# Altium schematic sheet LOADS AND POWER.SchDoc
size A4; SheetNumber: 4; SheetTotal: 4
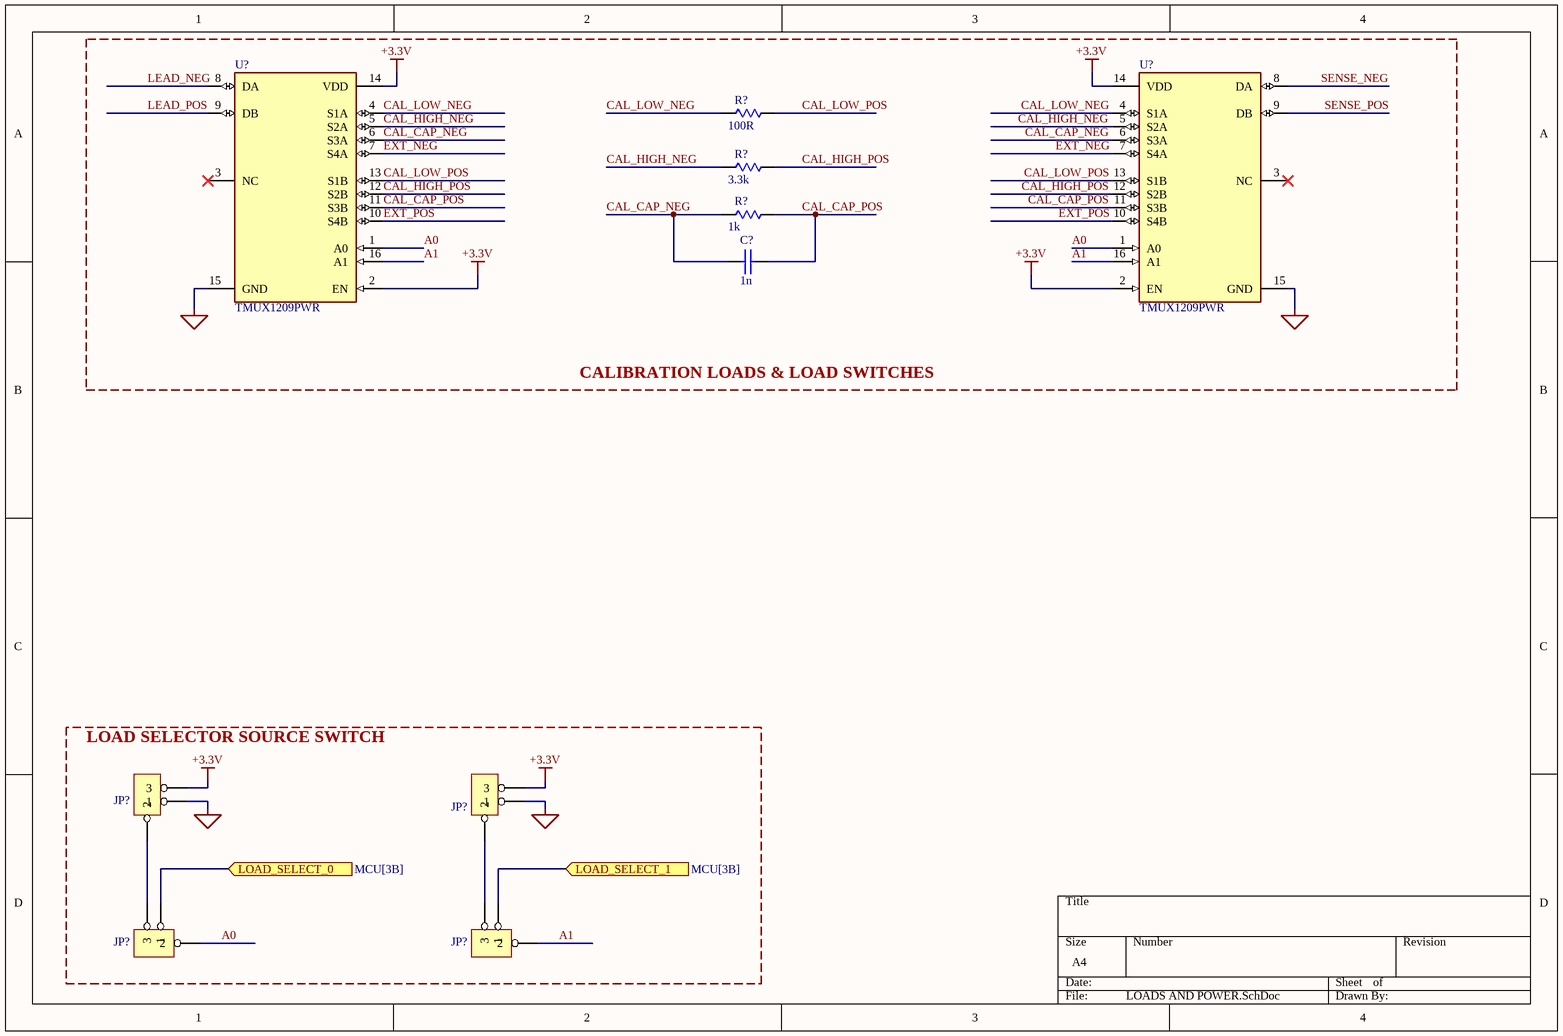
[diagram p0: LOADS AND POWER.SchDoc]

## Parts
(Parts that share a designator on the sheet are numbered #1, #2 ... from top to bottom, then left to right.)
C?  1n  [0805-CAP]
JP?#1  JUMPER1X3  [JUMPER3]  (value not drawn)
JP?#2  JUMPER1X3  [JUMPER3]  (value not drawn)
JP?#3  JUMPER1X3  [JUMPER3]  (value not drawn)
JP?#4  JUMPER1X3  [JUMPER3]  (value not drawn)
R?#1  100R  [0805-RES]
R?#2  3.3k  [0805-RES]
R?#3  1k  [0805-RES]
U?#1  TMUX1209PWR  [FP-PW0016A-MFG]
U?#2  TMUX1209PWR  [FP-PW0016A-MFG]

## Blocks framed on the sheet
CALIBRATION LOADS & LOAD SWITCHES: C? R?#1-R?#3 U?#1 U?#2
LOAD SELECTOR SOURCE SWITCH: JP?#1-JP?#4

## Ports
LOAD_SELECT_0 (in, see MCU[3B]), LOAD_SELECT_1 (in, see MCU[3B])

## Nets
+3.3V: JP?#1.3 JP?#2.3 U?#1.2(EN) U?#1.14(VDD) U?#2.2(EN) U?#2.14(VDD)
GND: JP?#1.1 JP?#2.1 U?#1.15(GND) U?#2.15(GND)
A0: JP?#3.2 U?#1.1(A0) U?#2.1(A0)
A1: JP?#4.2 U?#1.16(A1) U?#2.16(A1)
CAL_CAP_NEG: C?.1 R?#3.2 U?#1.6(S3A) U?#2.6(S3A)
CAL_CAP_POS: C?.2 R?#3.1 U?#1.11(S3B) U?#2.11(S3B)
CAL_HIGH_NEG: R?#2.2 U?#1.5(S2A) U?#2.5(S2A)
CAL_HIGH_POS: R?#2.1 U?#1.12(S2B) U?#2.12(S2B)
CAL_LOW_NEG: R?#1.2 U?#1.4(S1A) U?#2.4(S1A)
CAL_LOW_POS: R?#1.1 U?#1.13(S1B) U?#2.13(S1B)
EXT_NEG: U?#1.7(S4A) U?#2.7(S4A)
EXT_POS: U?#1.10(S4B) U?#2.10(S4B)
LEAD_NEG: U?#1.8(DA)
LEAD_POS: U?#1.9(DB)
LOAD_SELECT_0: JP?#3.1 ; port LOAD_SELECT_0
LOAD_SELECT_1: JP?#4.1 ; port LOAD_SELECT_1
SENSE_NEG: U?#2.8(DA)
SENSE_POS: U?#2.9(DB)
NetJP?#1_2: JP?#1.2 JP?#3.3
NetJP?#2_2: JP?#2.2 JP?#4.3

Not connected (* = marked no-connect by the designer): U?#1 3(NC)*; U?#2 3(NC)*

## Library data of the parts
C? = CL21B104KCFNNNE: CAP CER 100pF C0G 0805; Manufacturer 1: Samsung; Detailed Description: CAP CER 0.1UF 100V X7R 0805; Tech#: SMT; Manufacturer Part Number 1: CL21B104KCFNNNE; Supplier 1: DigiKey; Supplier Part Number 1: 1276-6840-1-ND; Supplier 2: Mouser; Supplier Part Number 2: 791-0603B104K101CT; Price(100): 0.019
JP?#1-JP?#4 = 68001-203HLF: CONN HEADER VERT 36POS 2.54MM; Manufacturer 1: FCI; Detailed Description: Jumper, 1x3 Vertical T/H 0.1in; Location: #N/A; Notes: Can be 68001-236HLF cut to length; Tech#: T/H; Manufacturer Part Number 1: 68001-203HLF; Supplier 1: DigiKey; Supplier Part Number 1: 609-3470-ND; Supplier 2: Mouser; Supplier Part Number 2: 649-68001-203HLF; Price(1): 0.43; Price(10): 0.32; Price(25): 0.32; Price(100): 0.2436
R?#1 = 240R 0.1%: RES SMD 100 OHM 0.1% 1/8W 0805; Manufacturer Part Number 1: RG2012P-241-B-T5; Manufacturer 1: Susumu; Detailed Description: RES SMD 240 OHM 0.1% 1/8W 0805; Tech#: SMT; Supplier 1: Mouser; Supplier Part Number 1: 754-RG2012P-241-BT5; Supplier 2: DigiKey; Supplier Part Number 2: RG20P240BCT-ND; Price(100): 0.149
R?#2 = 240R 0.1%: RES SMD 3.3k OHM 0.1% 1/8W 0805; Manufacturer Part Number 1: RG2012P-241-B-T5; Manufacturer 1: Susumu; Detailed Description: RES SMD 240 OHM 0.1% 1/8W 0805; Tech#: SMT; Supplier 1: Mouser; Supplier Part Number 1: 754-RG2012P-241-BT5; Supplier 2: DigiKey; Supplier Part Number 2: RG20P240BCT-ND; Price(100): 0.149
R?#3 = 240R 0.1%: RES SMD 1kOHM 0.1% 1/8W 0805; Manufacturer Part Number 1: RG2012P-241-B-T5; Manufacturer 1: Susumu; Detailed Description: RES SMD 240 OHM 0.1% 1/8W 0805; Tech#: SMT; Supplier 1: Mouser; Supplier Part Number 1: 754-RG2012P-241-BT5; Supplier 2: DigiKey; Supplier Part Number 2: RG20P240BCT-ND; Price(100): 0.149
U?#1 U?#2 = CMP-04892-000106-1: IC SWITCH DUAL 16TSSOP